# EAGLE design Módulo_Ribatski v.1.0 (EAGLE 9.2.2)
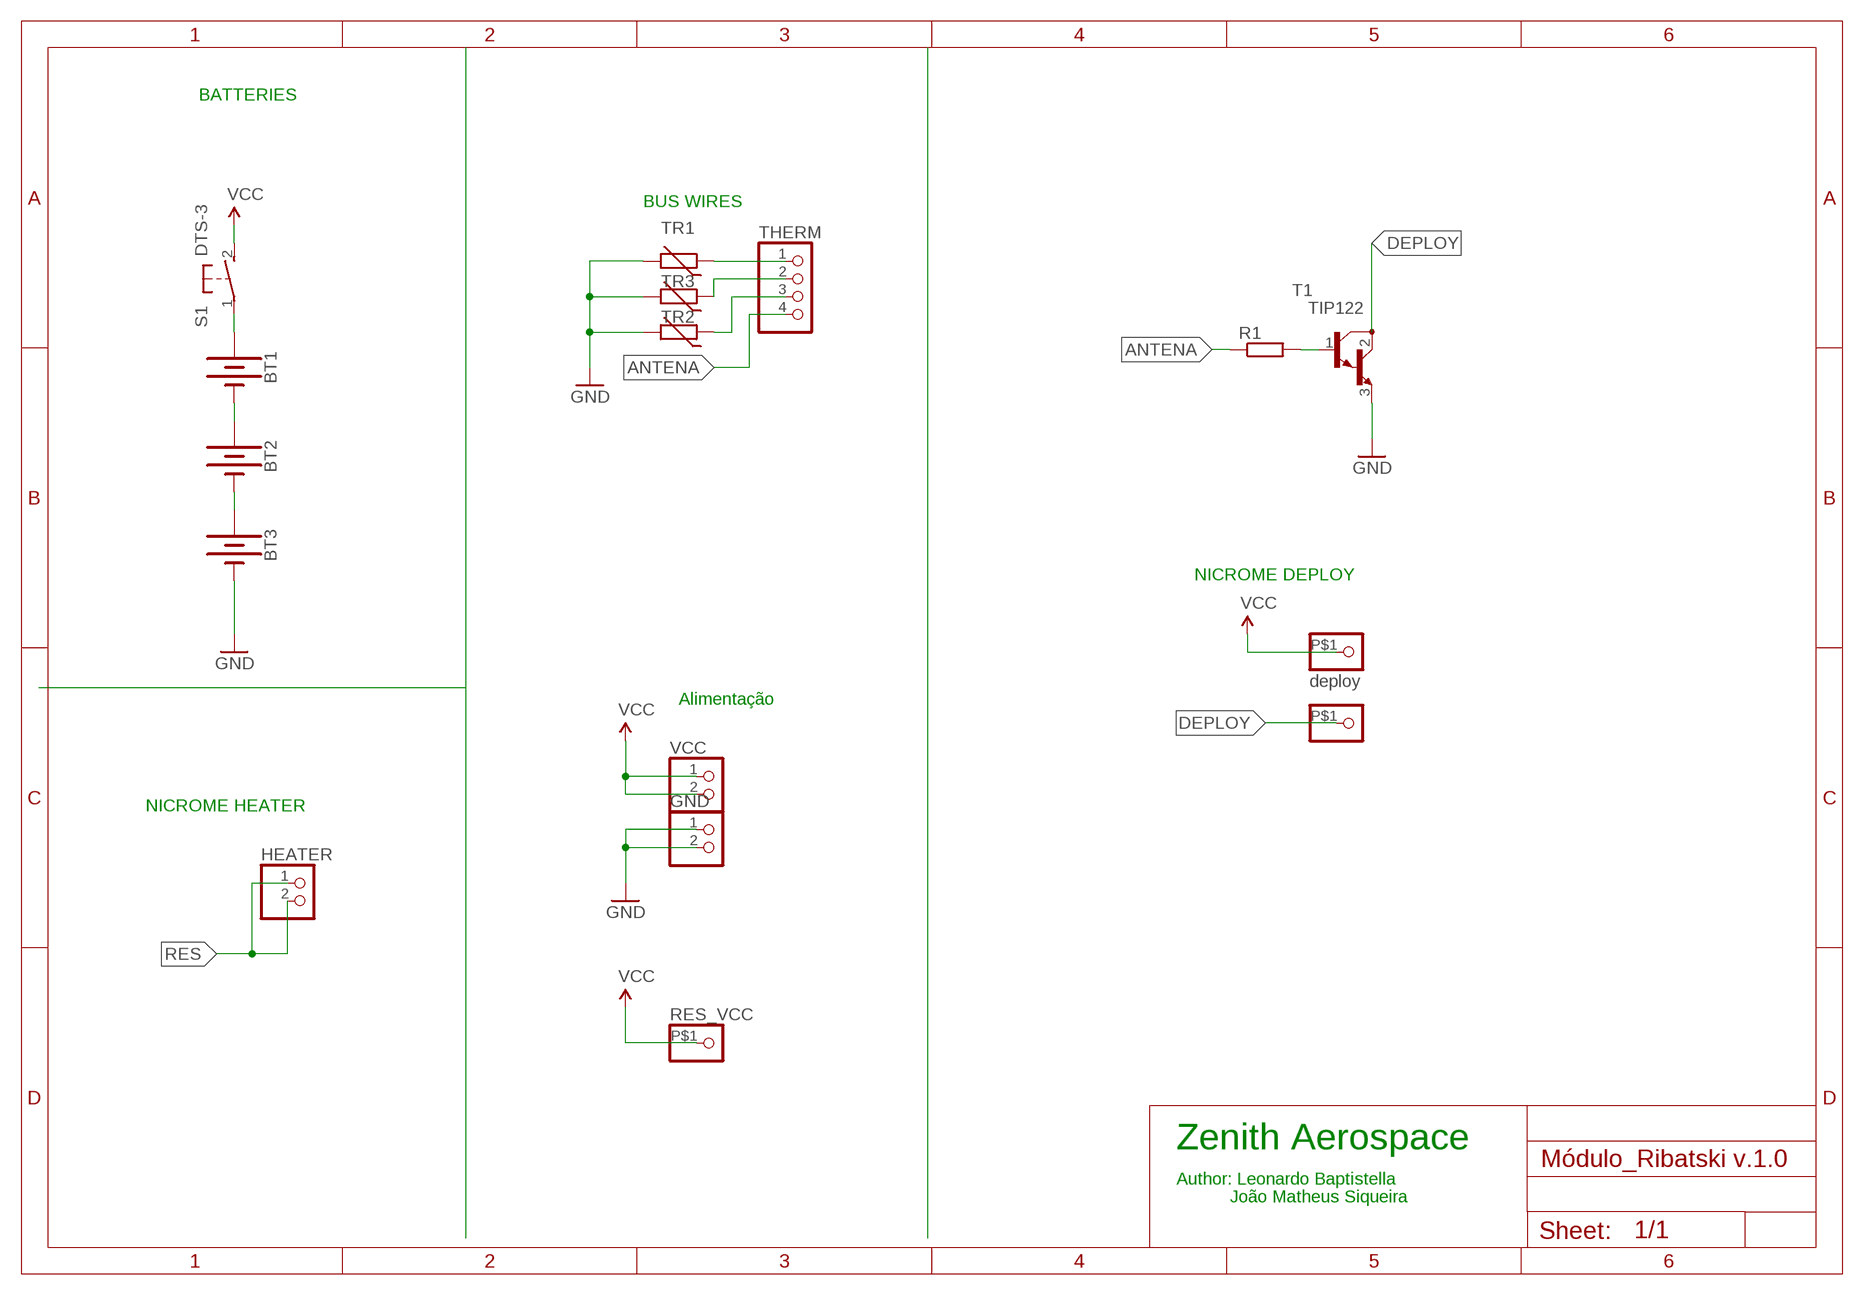
[diagram p0: schematic, sheet 1]

## Parts
BT1  BATTERY-18650  [BATTERY_18650-HOLDER]
BT2  BATTERY-18650  [BATTERY_18650-HOLDER]
BT3  BATTERY-18650  [BATTERY_18650-HOLDER]
DEPLOY_GND  PINHD-1X1-BIGPOGO  [1X1-BIGPOGO]
DEPLOY_VCC  deploy  PINHD-1X1-BIGPOGO  [1X1-BIGPOGO]
GND  PINHD-1X2  [1X02]
HEATER  PINHD-1X2  [1X02]
R1  R-EU_R1206  [R1206]
RES_VCC  PINHD-1X1-BIGPOGO  [1X1-BIGPOGO]
S1  DTS-3  [DTS-3]
T1  TIP122  [TO220]
THERM  HEADER-1X4  [1X04_OVAL]
TR1  THERMISTOR_R-5  [R-5]
TR2  THERMISTOR_R-5  [R-5]
TR3  THERMISTOR_R-5  [R-5]
VCC  PINHD-1X2  [1X02]

## Nets
ANTENA: R1.1 THERM.4
DEPLOY: DEPLOY_GND.P$1 T1.2(C)
GND: BT3.GND@1(-) GND.1 GND.2 T1.3(E) TR1.2 TR2.2 TR3.2
N$1: BT1.GND@1(-) BT2.PWR@1(+)
N$2: BT2.GND@1(-) BT3.PWR@1(+)
N$3: THERM.1 TR1.1
N$4: THERM.2 TR3.1
N$5: THERM.3 TR2.1
N$8: R1.2 T1.1(B)
N$9: BT1.PWR@1(+) S1.1
RES: HEATER.1 HEATER.2
VCC: DEPLOY_VCC.P$1 RES_VCC.P$1 S1.2 VCC.1 VCC.2

## Notes on the sheet
- BATTERIES
- BUS WIRES
- NICROME DEPLOY
- Alimentação
- NICROME HEATER
- Zenith Aerospace
- Author: Leonardo Baptistella
- João Matheus Siqueira

## Library data of the parts
BT1-BT3 = SparkFun-Batteries:BATTERY: Battery - Single Cell A variety of battery chemistries, sizes, and footprints. Device List: 20MM_PTH - Coin Cell Battery Holder - 20mm (PTH) <https://www.sparkfun.com/products/783> 6.8MM_PTH - Coin Cell Battery Holder - 6.8MM(SMD) <https://www.digikey.com/product-detail/en/seiko-instruments/MS621FE-FL11E/728-1057-ND/1889208?WT.srch=1&gclid=CNOQ5a6LzdQCFZS2wAodXCkE0g> 12MM_SMD - Coin Cell Battery Holder - 12mm (SMD) <https://www.sparkfun.com/products/10592> 12MM_PTH - Coin Cell Battery Holder - 12mm (PTH) <https://www.sparkfun.com/products/7948> 20MM_SMD - 20mm Coin Cell Battery Holder (SMD) (2 legs) Used on the Big Time Watch Kit <https://www.sparkfun.com/products/11734> 20MM_SMD_4LEGS - Coin Cell Battery Holder - 20mm (SMD) <https://www.sparkfun.com/products/11892> 20MM_SMD_4LEGS_OVERPASTE - Coin Cell Battery Holder - 20mm (SMD) <https://www.sparkfun.com/products/11892> (Over-paste on the legs) 24.5MM_PTH - Coin Cell Battery Holder - 24.5mm (PTH) <https://www.sparkfun.com/products/8863> 9V - 9V Battery Holder - PC Mount Used on the SparkFun SparkPunk Sound Kit <https://www.sparkfun.com/products/11177> and SparkFun SparkPunk Sequencer Kit <https://www.sparkfun.com/products/12707> 18650 - Battery Holder - 18650 (PTH) <https://www.sparkfun.com/products/13113> AA - Battery Holder - 1xAA (PTH) <https://www.sparkfun.com/products/7949> AAA - Battery Holder - 1xAAA (PTH) <https://www.sparkfun.com/products/12718> AA_KIT - Battery Holder - 1xAA (PTH) <https://www.sparkfun.com/products/7949> Special kit package - pads only have exposed copper on one side of the board. AAA_KIT - Battery Holder - 1xAAA (PTH) <https://www.sparkfun.com/products/12718> Special kit package - pads only have exposed copper on one side of the board.; PROD_ID: BATT-12327; SF_SKU: PRT-13113
DEPLOY_GND DEPLOY_VCC RES_VCC = adafruit:PINHD-1X1: Pin header 1x1 for 0.1" spacing With round pins
GND HEATER VCC = pinhead:PINHD-1X2: PIN HEADER
R1 = rcl:R-EU_: RESISTOR, European symbol
S1 = switch-tact:DTS-3
T1 = transistor:TIP122: NPN BIPOLAR DARLINGTON TRANSISTOR
THERM = microbuilder:HEADER-1X4: PIN HEADER
TR1-TR3 = discrete:THERMISTOR_: Thermo Resistor

## Board
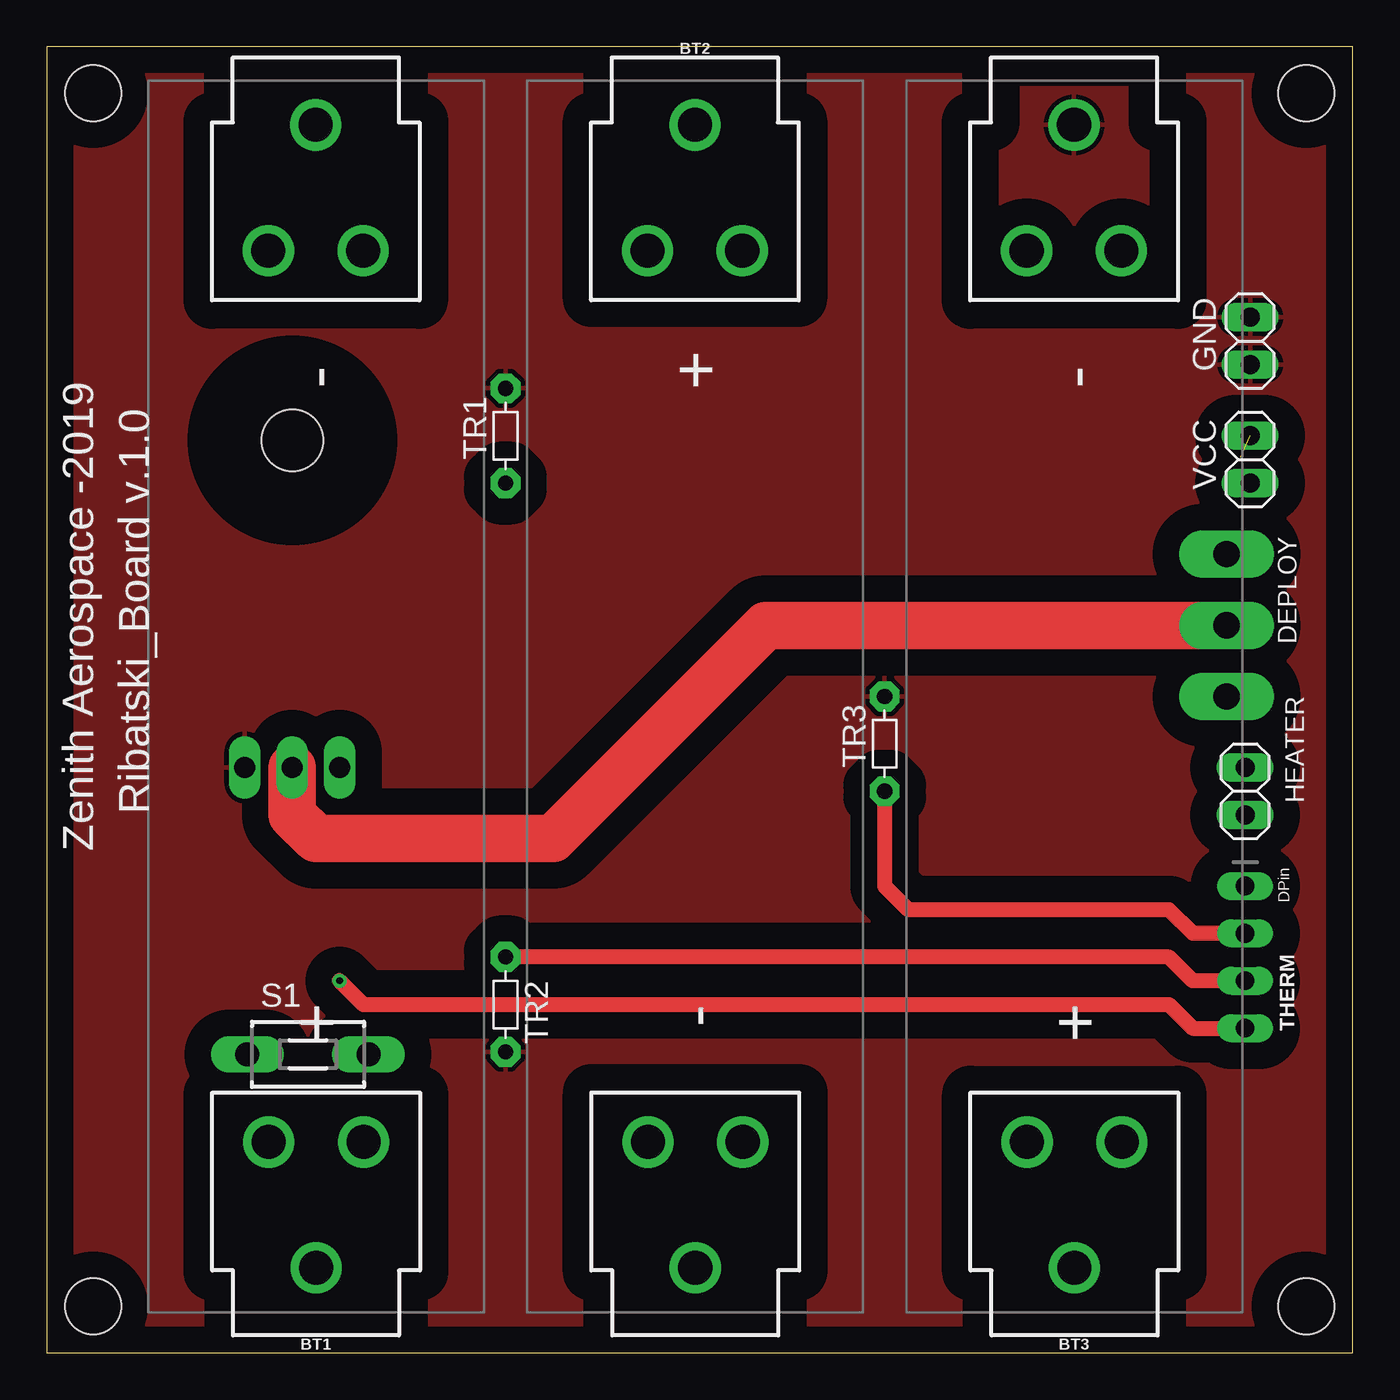
[diagram p1: board, top side]
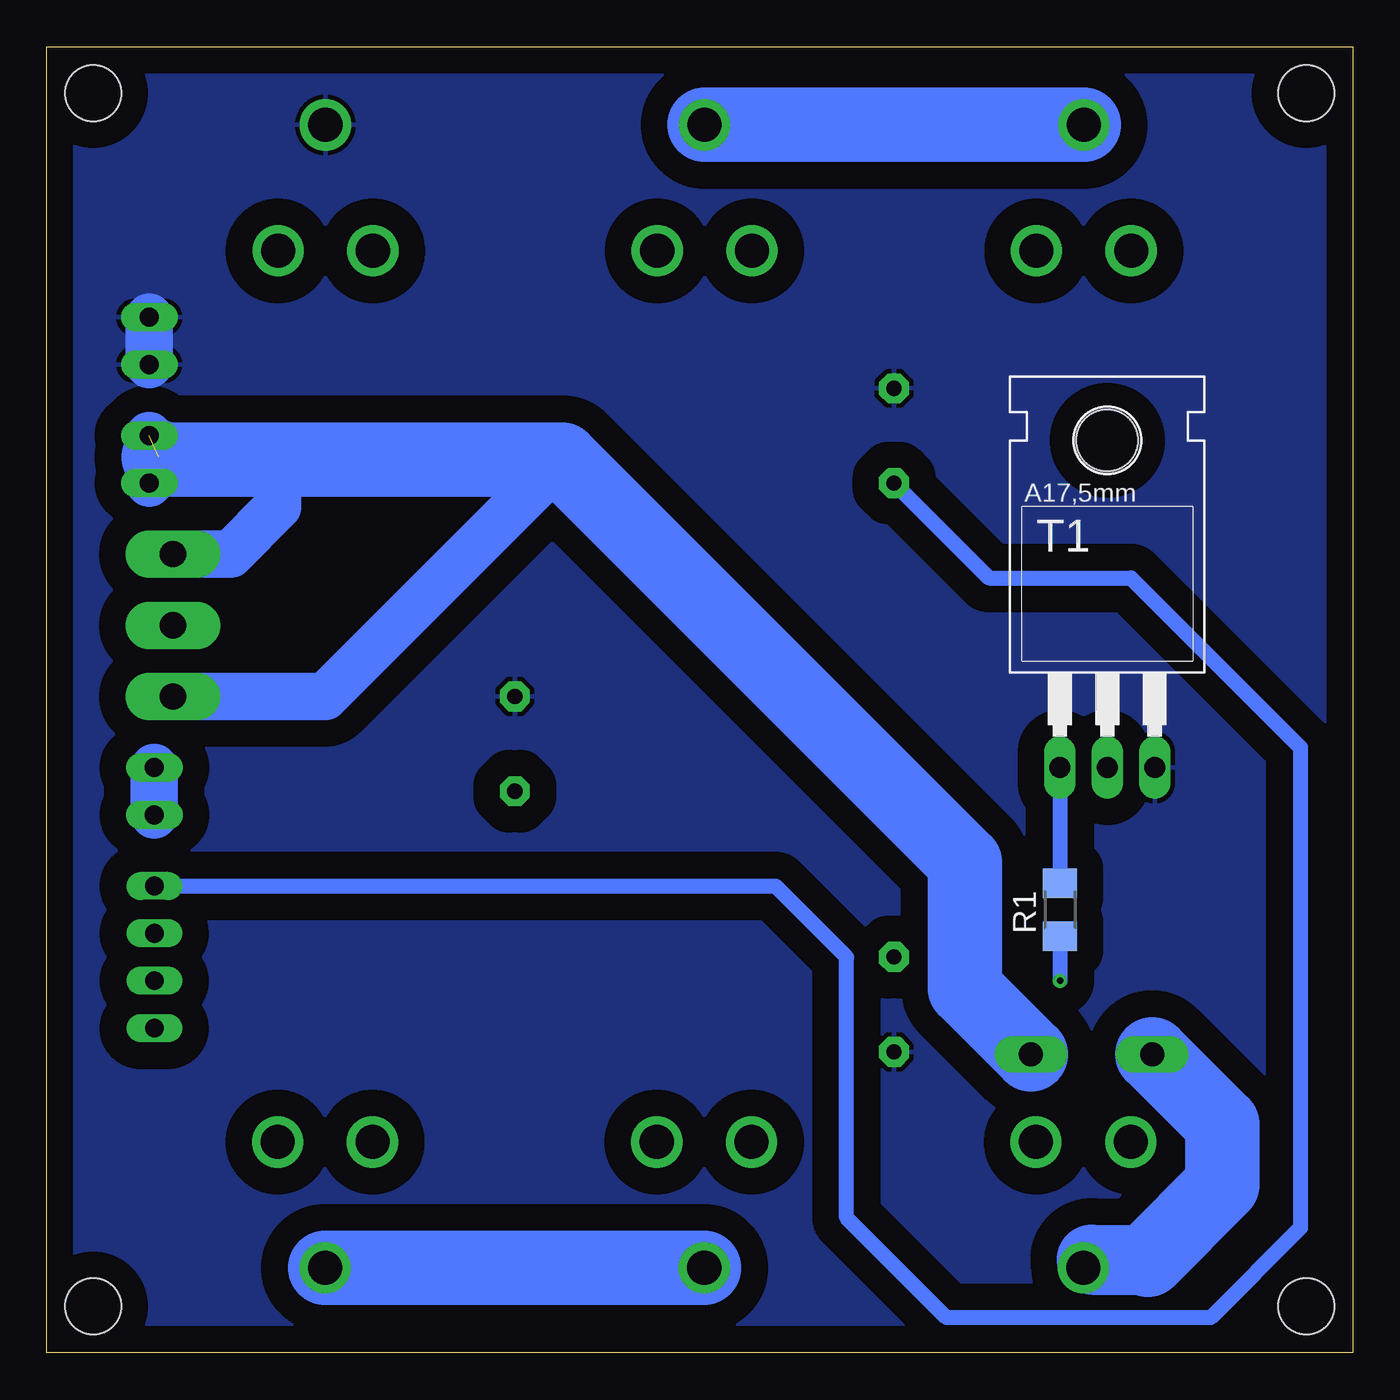
[diagram p2: board, bottom side, seen from below]

Size 70 x 70 mm. Coordinates in mm from the lower left corner, seen from the top.
Outline: 0,0 70,0 70,70 0,70 0,0
Copper layers (1*16): Top 0.035mm / dielectric 1.5mm / Bottom 0.035mm
Design rules "default": minimum track width 6mil, minimum drill 0.35mm, track to track 6mil, track to pad 6mil, pad to pad 6mil, via to via 6mil, smd to smd 6mil, copper to edge 40mil, drill to drill 6mil, minimum pad ring 10mil, minimum via ring 8mil, stop-mask expansion 4mil, vias tented up to drill 0mil, thermal gap 10mil
Holes 3 mm at 2.5,67.5 67.5,67.5 67.5,2.5 2.5,2.5

### Footprints (pad centres in the part's own frame; a part is rotated, then mirrored left to right if it is on the bottom)
BATTERY_18650-HOLDER = drill 1.829: GND@1 30.628,0.01; GND@2 23.88,2.55; GND@3 23.88,-2.53; PWR@1 -30.628,-0.01; PWR@2 -23.88,2.53; PWR@3 -23.88,-2.55
1X1-BIGPOGO = drill 1.4 pad 2.54 long: P$1 0,0
1X02 = drill 1.016 long: 1 -1.27,0; 2 1.27,0
R1206 = smd 1.6 x 1.803: 1 -1.422,0; 2 1.422,0
DTS-3 = drill 1.3 long: 1 -3.25,0; 2 3.25,0
TO220 = drill 1.118 long: 1 -2.54,-6.35; 2 0,-6.35; 3 2.54,-6.35 | hole 3.302: 0,11.176
1X04_OVAL = drill 1 long: 1 -3.81,0; 2 -1.27,0; 3 1.27,0; 4 3.81,0
R-5 = drill 0.813 pad 1.6 octagon: 1 -2.54,0; 2 2.54,0

### Placement (x,y rotation side)
BT1  14.43,35.18 90 top
BT2  34.75,35.18 270 top
BT3  55.07,35.18 90 top
DEPLOY_GND  63.23,38.99 180 top
DEPLOY_VCC  63.23,42.8 0 top
GND  64.5,54.23 90 top
HEATER  64.23,30.1 90 top
R1  15.7,23.75 90 bottom
RES_VCC  63.23,35.18 0 top
S1  14,16 0 top
T1  13.16,37.72 0 bottom
THERM  64.23,21.21 270 top
TR1  24.59,49.15 90 top
TR2  24.59,18.67 270 top
TR3  44.91,32.64 90 top
VCC  64.5,47.88 90 top

### Tracks (layer width: path | path; a pad name or v marks a point on that pad's centre or on a via)
ANTENA  (via drill 0.35)
  Top 0.813: v15.7,19.94 16.97,18.67 60.15,18.67 61.42,17.4 THERM.4
  Bottom 0.813: R1.1 v15.7,19.94
DEPLOY
  Top 2.54: T1.2 13.16,28.83 14.43,27.56 27.13,27.56 38.56,38.99 DEPLOY_GND.P$1
GND
  Bottom 2.54: GND.1 GND.2
  pour Top (isolate 1.422): 0,70 70,70 70,0 0,0
  pour Bottom (isolate 1.422): 0,70 70,70 70,0 0,0
N$1
  Bottom 4: BT2.PWR@1 BT1.GND@1
N$2
  Bottom 4: BT3.PWR@1 BT2.GND@1
N$3
  Bottom 0.813: TR1.1 19.51,41.53 11.89,41.53 2.81,32.45 2.81,6.7 7.62,1.89 21.78,1.89 27.13,7.24 27.13,21.21 30.94,25.02 THERM.1
N$4
  Top 0.813: THERM.2 61.42,22.48 60.15,23.75 46.18,23.75 44.91,25.02 TR3.1
N$5
  Top 0.813: THERM.3 61.42,19.94 60.15,21.21 TR2.1
N$8
  Bottom 0.813: T1.1 R1.2
N$9
  Bottom 0.254: BT1.PWR@1 14,4.99 14,5
  Bottom 3.75: 14,5 11,5
  Bottom 4: S1.1 7,12.25 7,9 11,5
RES
  Bottom 2.54: HEATER.1 HEATER.2
VCC  (1 unrouted)
  Bottom 2.54: 42.37,47.88 55.07,35.18 RES_VCC.P$1 | DEPLOY_VCC.P$1 60.15,42.8 57.61,45.34 57.61,47.88 | VCC.2 VCC.1
  Bottom 4: 64,48 63.88,47.88 57.61,47.88 42.37,47.88 20.78,26.29 20.78,19.53 S1.2

### Text on the board
tNames: DEPLOY | Ribatski_Board v.1.0 | Zenith Aerospace -2019 | DPin